# Altium project radFET-calibration_stand.PrjPcb
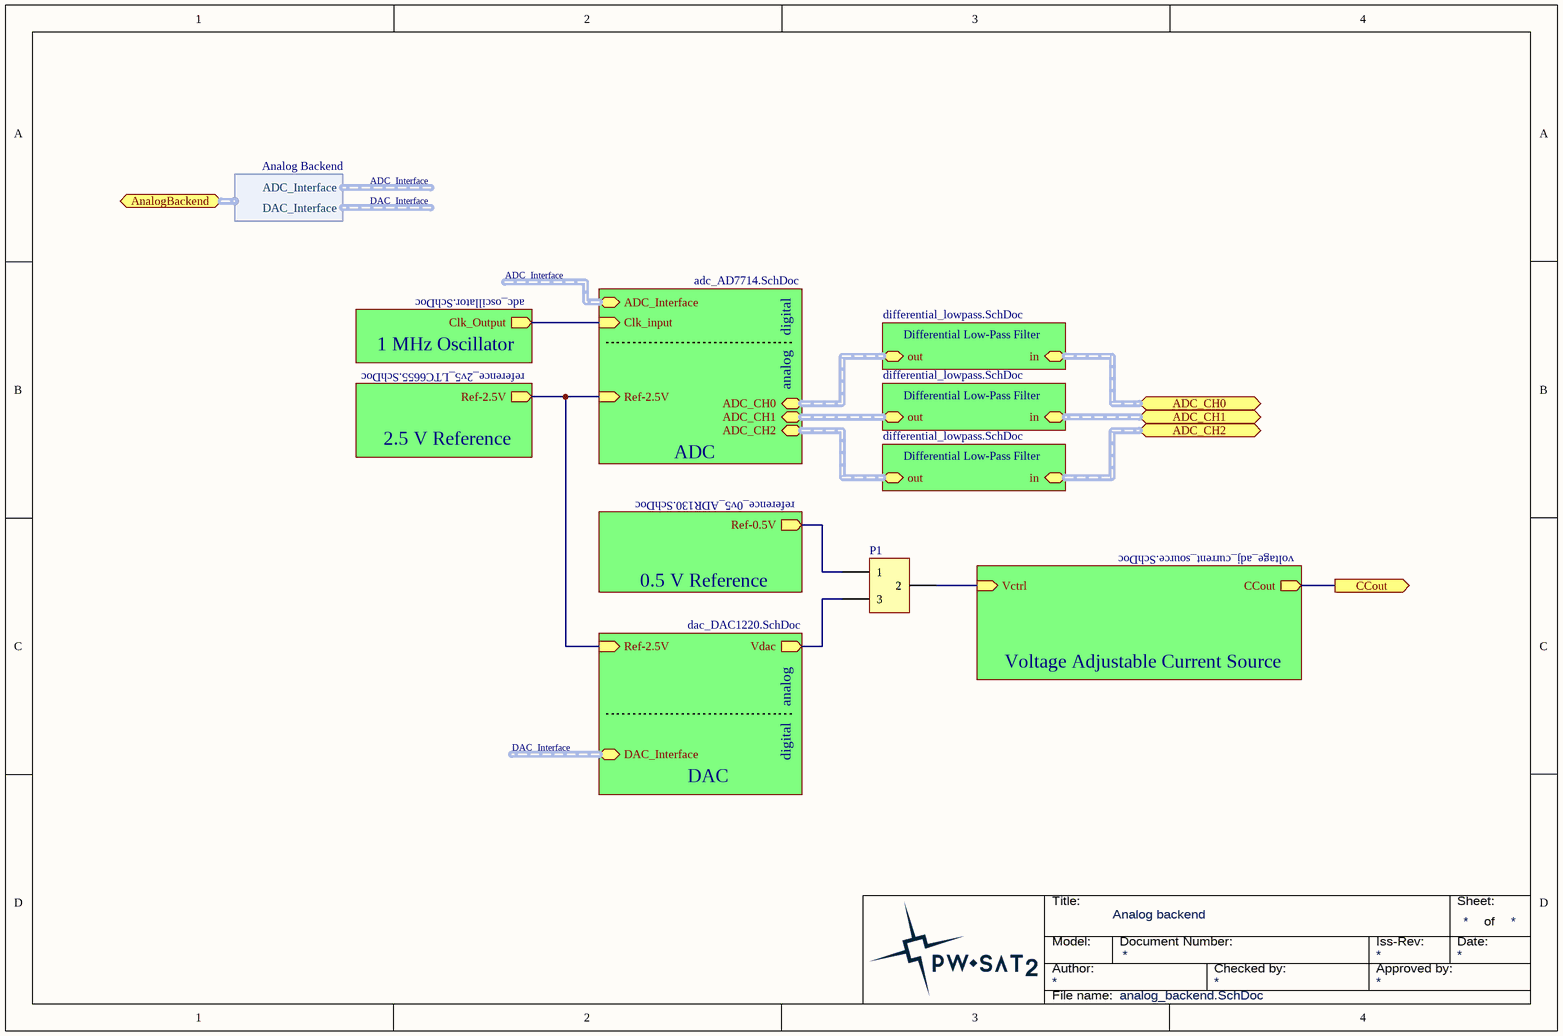
[diagram p0: analog_backend.SchDoc]
11 sheets, 161 parts. Net scope: hierarchical (ports join the sheet entries above them; power ports are global).
Board file: PCB1.PcbDoc
Sheets:
  analog_backend.SchDoc
    ADC = adc_AD7714.SchDoc
    2.5 V Reference = reference_2v5_LTC6655.SchDoc
    Voltage Adjustable Current Source = voltage_adj_current_source.SchDoc
    0.5 V Reference = reference_0v5_ADR130.SchDoc
    Differential Low-Pass Filter = differential_lowpass.SchDoc
    Differential Low-Pass Filter = differential_lowpass.SchDoc
    Differential Low-Pass Filter = differential_lowpass.SchDoc
  mcu_atmega.SchDoc
  rtd_interface_MAX31865.SchDoc
  wifi_ESP8266.SchDoc
  power_unit.SchDoc
  uart_optoizolation.SchDoc

## Sheet analog_backend.SchDoc: Analog backend
size A4

### Parts
P1  Option_Header  [HEADER 1X3 MALE]  (value not drawn)

### Sub-sheets
0.5 V Reference = reference_0v5_ADR130.SchDoc: Ref-0.5V (out)
1 MHz Oscillator = adc_oscillator.SchDoc (file not in this document): Clk_Output (out)
2.5 V Reference = reference_2v5_LTC6655.SchDoc: Ref-2.5V (out)
ADC = adc_AD7714.SchDoc: Ref-2.5V (in), ADC_Interface (harness ADC_DIGITAL), ADC_CH1 (harness ADC Channel), ADC_CH2 (harness ADC Channel), ADC_CH0 (harness ADC Channel), Clk_input (in)
DAC = dac_DAC1220.SchDoc (file not in this document): Ref-2.5V (in), DAC_Interface (harness DAC_DIGITAL), Vdac (out)
Differential Low-Pass Filter = differential_lowpass.SchDoc: out (harness ADC Channel), in (harness ADC Channel)
Differential Low-Pass Filter = differential_lowpass.SchDoc: out (harness ADC Channel), in (harness ADC Channel)
Differential Low-Pass Filter = differential_lowpass.SchDoc: out (harness ADC Channel), in (harness ADC Channel)
Voltage Adjustable Current Source = voltage_adj_current_source.SchDoc: Vctrl (in), CCout (out)

### Ports
ADC_CH0, ADC_CH1, ADC_CH2, AnalogBackend (harness Analog Backend), CCout (out)

### Harnesses
Analog Backend: ADC_Interface, DAC_Interface

### Nets
CCout: port CCout, sheet Voltage Adjustable Current Source/CCout
Clk_input: sheet ADC/Clk_input, sheet 1 MHz Oscillator/Clk_Output
Ref-0.5V: P1.1 ; sheet 0.5 V Reference/Ref-0.5V
Ref-2.5V: sheet ADC/Ref-2.5V, sheet 2.5 V Reference/Ref-2.5V, sheet DAC/Ref-2.5V
Vctrl: P1.2 ; sheet Voltage Adjustable Current Source/Vctrl
NetP1_3: P1.3 ; sheet DAC/Vdac

### Buses and harness runs
harness ADC_Interface = sheet ADC/ADC_Interface
harness DAC_Interface = sheet DAC/DAC_Interface
harness port ADC_CH0 = sheet Differential Low-Pass Filter/in
harness port ADC_CH1 = sheet Differential Low-Pass Filter/in
harness port ADC_CH2 = sheet Differential Low-Pass Filter/in
harness sheet ADC/ADC_CH0 = sheet Differential Low-Pass Filter/out
harness sheet ADC/ADC_CH1 = sheet Differential Low-Pass Filter/out
harness sheet ADC/ADC_CH2 = sheet Differential Low-Pass Filter/out

### Notes on the sheet
- analog
- digital
- Title:
- Sheet:
- of
- Author:
- Model:
- Document Number:
- Checked by:
- Iss-Rev:
- Approved by:
- Date:
- File name:

### Library data of the parts
P1 = Option_Header: Option Header, 3-Pin; LatestRevisionDate: 17-Jul-2002; LatestRevisionNote: Re-released for DXP Platform.; Publisher: Altium Limited

## Sheet adc_AD7714.SchDoc: A 24-bit AD7714YRZ Analog-to-Digital Converter
size A4
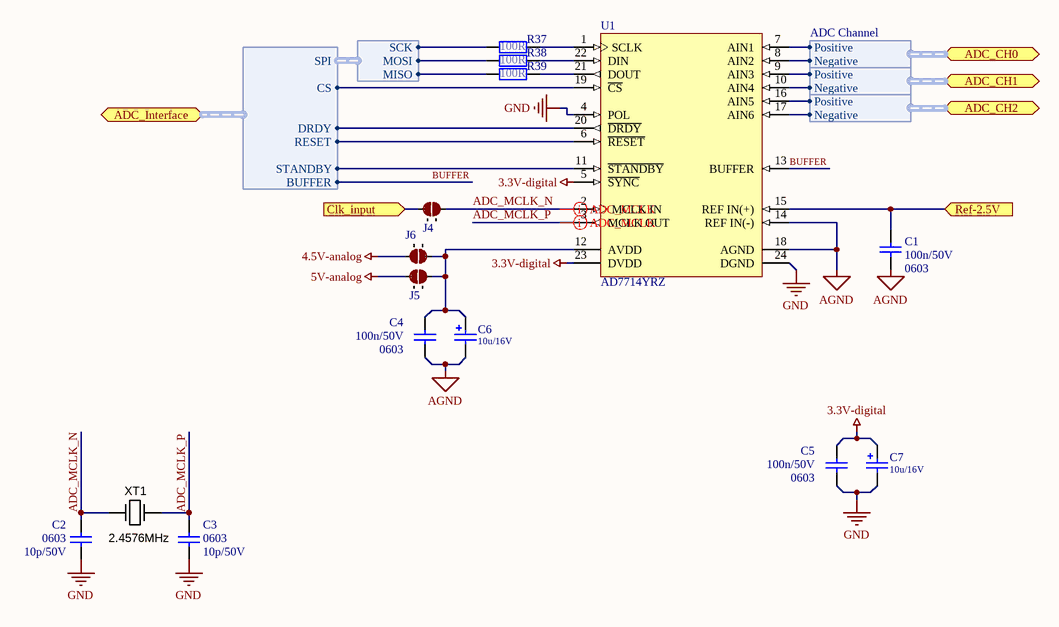
[diagram p1: adc_AD7714.SchDoc]

### Parts
C1  Package: 0603  [SMD_Capacitor_0603]  (hidden comment: 100n/50V)
C2  Package: 0603  [SMD_Capacitor_0603]  (hidden comment: 10p/50V)
C3  Package: 0603  [SMD_Capacitor_0603]  (hidden comment: 10p/50V)
C4  Package: 0603  [SMD_Capacitor_0603]  (hidden comment: 100n/50V)
C5  Package: 0603  [SMD_Capacitor_0603]  (hidden comment: 100n/50V)
C6  10u/16V  [Tantalum_cap_B]
C7  10u/16V  [Tantalum_cap_B]
J4  2 way net solder junction - Normally Open  [2waySolder_NO - 20 mils]  (value not drawn)  (no BOM)
J5  2 way net solder junction - Normally Open  [2waySolder_NO - 20 mils]  (value not drawn)  (no BOM)
J6  2 way net solder junction - Normally Open  [2waySolder_NO - 20 mils]  (value not drawn)  (no BOM)
R37  100R  [0603]
R38  100R  [0603]
R39  100R  [0603]
U1  AD7714YRZ  [RW-24_M]
XT1  2.4576MHz  [HC49U]

### Ports
ADC_CH0 (harness ADC Channel), ADC_CH1 (harness ADC Channel), ADC_CH2 (harness ADC Channel), ADC_Interface (harness ADC_DIGITAL), Clk_input (in), Ref-2.5V (in)

### Harnesses
ADC_DIGITAL: DRDY, RESET, STANDBY, BUFFER, CS, SPI
SPI: SCK, MOSI, MISO
ADC Channel: Positive, Negative

### Nets
3.3V-digital: C5.1 C7.1 U1.5(~{SYNC}) U1.23(DVDD)
4.5V-analog: J6.2
5V-analog: J5.1
AGND: C1.2 C4.2 C6.2 U1.14(REF_IN(-)) U1.18(AGND)
GND: C2.2 C3.2 C5.2 C7.2 U1.4(POL) U1.24(DGND)
ADC_Interface.CS: U1.19(~{CS}) ; port ADC_Interface.CS
ADC_Interface.DRDY: U1.20(~{DRDY}) ; port ADC_Interface.DRDY
ADC_Interface.RESET: U1.6(~{RESET}) ; port ADC_Interface.RESET
ADC_Interface.STANDBY: U1.11(~{STANDBY}) ; port ADC_Interface.STANDBY
ADC_MCLK_N: C2.1 J4.2 U1.2(MCLK_IN) XT1.1(IN)
ADC_MCLK_P: C3.1 U1.3(MCLK_OUT) XT1.2(OUT)
BUFFER: U1.13(BUFFER) ; port ADC_Interface.BUFFER  [project net ADC_Interface.BUFFER]
Clk_input: J4.1 ; port Clk_input
Ref-2.5V: C1.1 U1.15(REF_IN(+)) ; port Ref-2.5V
NetC4_1: C4.1 C6.1 J5.2 J6.1 U1.12(AVDD)
NetC89_Differential_Low-Pass_Filter#1_1: U1.7(AIN1) ; port ADC_CH0.Positive
NetC89_Differential_Low-Pass_Filter#2_1: U1.9(AIN3) ; port ADC_CH1.Positive
NetC89_Differential_Low-Pass_Filter#3_1: U1.16(AIN5) ; port ADC_CH2.Positive
NetC90_Differential_Low-Pass_Filter#1_2: U1.8(AIN2) ; port ADC_CH0.Negative
NetC90_Differential_Low-Pass_Filter#2_2: U1.10(AIN4) ; port ADC_CH1.Negative
NetC90_Differential_Low-Pass_Filter#3_2: U1.17(AIN6) ; port ADC_CH2.Negative
NetR37_1: R37.1 ; harness SPI.SCK
NetR37_2: R37.2 U1.1(SCLK)
NetR38_1: R38.1 ; harness SPI.MOSI
NetR38_2: R38.2 U1.22(DIN)
NetR39_1: R39.1 ; harness SPI.MISO
NetR39_2: R39.2 U1.21(DOUT)

### Layout directives
differential pair: ADC_MCLK_N, ADC_MCLK_P

### Notes on the sheet
- Title:
- Sheet:
- of
- Author:
- Model:
- Document Number:
- Checked by:
- Iss-Rev:
- Approved by:
- Date:
- File name:

### Library data of the parts
C1 C4 C5 = Cer_C0603T104K5RALTU: Ceramic Cap Kemet COTS 100n/50V X7R 0603; Manufacturer: Kemet; ManufacturerPartNumber: C0603T104K5RALTU; Value: 100n/50V
C2 C3 = Cer_GCM1885C1H100JA16D: Ceramic Cap Murata Automotive 10p/50V C0G 0603; Manufacturer: Murata; ManufacturerPartNumber: GCM1885C1H100JA16D; Value: 10p/50V
C6 C7 = Cap Tantalum: Tantalum Capacitor; Value: 10u/16V
J4-J6 = 2waySolderNO: ComponentLink1URL: http://www.edatools.cz/addons; ComponentLink1Description: Source
R37-R39 = Res: Generic resistor; value: 100R
U1 = AD7714YRZ: 5 Channel 24-Bit Signal Conditioning Analog-to-Digital Converter with Serial, SPI Interface, 500 uA, CMOS, 3 V / 5 V, 1KSPS, -40 to +105 degC, RW-24, Pb-Free, Tube; Generic Part Number: AD7714; Manufacturer: Analog Devices; Resolution (Bits): 24; Channels: 5; Throughput Rate (SPS): 1K; Interface: Ser, SPI; DatasheetVersion: Rev.C; PackageVersion: 060706-A; PackageReference: RW-24; PackageDescription: 24-Lead Standard Small Outline Package [SOIC_W]; Supplier 1: Digi-Key; Supplier Part Number 1: AD7714YRZ-ND; Supplier 2: Farnell; Supplier Part Number 2: 1438858; Supplier 3: Newark; Supplier Part Number 3: 15P0854; Supplier 4: Newark; Supplier Part Number 4: 59K5335; Supplier 5: Mouser; Supplier Part Number 5: 584-AD7714YRZ; RoHS: Y; Packing: Tube; Mounting Technology: Surface Mount; Code_JEDEC: MS-013-AD; PartNumber: AD7714YRZ; ComponentLink1Description: Manufacturer URL; ComponentLink1URL: http://www.analog.com/en/index.html; ComponentLink2Description: Datasheet; ComponentLink2URL: http://www.analog.com/static/imported-files/data_sheets/AD7714.pdf; ComponentLink3Description: Package Specification; ComponentLink3URL: http://www.analog.com/static/imported-files/packages/33665150946139RW_24.pdf; ComponentLink4Description: Product URL; ComponentLink4URL: http://www.analog.com/en/analog-to-digital-converters/ad-converters/ad7714/products/product.html
XT1 = Crystal: AKER  C-2.4576-18-3050-X; Manufacturer 1: Citizen Finetech Miyota; Manufacturer Part Number 1: CMR309T-6.000MABJ-UT; Ratings: 6.00 MHz; Frequency: 6MHz; Frequency Stability: ±50ppm; Frequency Tolerance: ±30ppm; Load Capacitance: 18pF; Operating Mode: Fundamental; SCDType: spec; Package / Case: Cylindrical Can, Radial; Type: MHz Crystal; Operating Temperature: -10°C ~ 60°C; Mounting Type: Surface Mount; Size / Dimension: 0.118" Dia x 0.346" L (3.00mm x 8.80mm); Height: 0.122" (3.10mm); Supplier 1: Digi-Key; Supplier Part Number 1: 300-8348-1-ND; Tolerance: ±50ppm; ComponentLink1URL: http://media.digikey.com/pdf/Data%20Sheets/Citizen%20PDFs/CMR310T%20CMR309T.pdf; ComponentLink1Description: http://media.digikey.com/pdf/Data%20Sheets/Citizen%20PDFs/CMR310T%20CMR309T.pdf; Value: 2.4576MHz

## Sheet reference_2v5_LTC6655.SchDoc
size A4
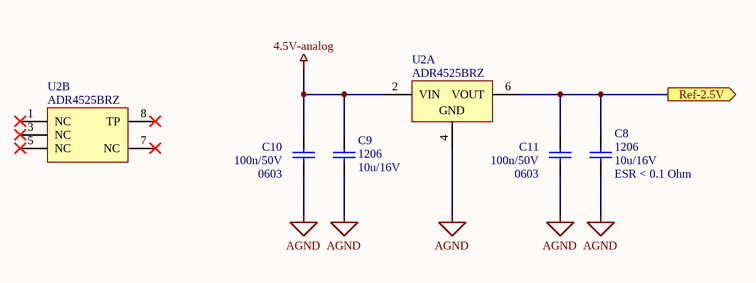
[diagram p2: reference_2v5_LTC6655.SchDoc]

### Parts
C8  Packge: 1206  [SMD_Capacitor_1206]  (hidden comment: 10u/16V)
C9  Packge: 1206  [SMD_Capacitor_1206]  (hidden comment: 10u/16V)
C10  Package: 0603  [SMD_Capacitor_0603]  (hidden comment: 100n/50V)
C11  Package: 0603  [SMD_Capacitor_0603]  (hidden comment: 100n/50V)
U2  ADR4525BRZ  [ADI-R-8_N]  (parts A,B of 2)

### Ports
Ref-2.5V (out)

### Nets
4.5V-analog: C9.1 C10.1 U2.2(VIN)
AGND: C8.2 C9.2 C10.2 C11.2 U2.4(GND)
Ref-2.5V: C8.1 C11.1 U2.6(VOUT) ; port Ref-2.5V

Not connected (* = marked no-connect by the designer): U2 1(NC)* 3(NC)* 5(NC)* 7(NC)* 8(TP)*

### Notes on the sheet
- (near C8) ESR < 0.1 Ohm
- Title:
- Sheet:
- of
- Author:
- Model:
- Document Number:
- Checked by:
- Iss-Rev:
- Approved by:
- Date:
- File name:

### Library data of the parts
C8 C9 = Cer_C1206T106K4RACTU: Ceramic Cap Kemet COTS 10u/16V X7R 1206; ManufacturerPartNumber: C1206T106K4RACTU; Manufacturer: Kemet; Value: 10u/16V
C10 C11 = Cer_C0603T104K5RALTU: Ceramic Cap Kemet COTS 100n/50V X7R 0603; Manufacturer: Kemet; ManufacturerPartNumber: C0603T104K5RALTU; Value: 100n/50V
U2 = ADR4525BRZ: Ultralow Noise, High Accuracy Voltage Reference, 2.5 V Output, 3 to 15 V Supply, Industrial, 8-pin SOIC (R-8), Tube; Manufacturer: Analog Devices; Max V Supply (V): 15; Min V Supply (V): 3; Ref Out TC (ppm/C): 2; Vout: 2.5V; DatasheetVersion: Rev. 0; PackageVersion: 060506-A, 06/2006; PackageReference: R-8; PackageDescription: 8-Pin Standard Small Outline Package, Body 4.9 x 3.9 mm, Pitch 1.27 mm; Supplier 1: Digi-Key; Supplier Part Number 1: ADR4525BRZ-ND; Supplier 2: Farnell; Supplier Part Number 2: 2112686; Supplier 3: Farnell; Supplier Part Number 3: 2148887; Supplier 4: Mouser; Supplier Part Number 4: 584-ADR4525BRZ; Packing: Tube; Operating Temp Range: -40 to 125 degC; Mounting Technology: Surface Mount; Code_JEDEC: MS-012-AA; PartNumber: ADR4525BRZ; ComponentLink1Description: Manufacturer URL; ComponentLink1URL: http://www.analog.com/en/index.html; ComponentLink2Description: Datasheet; ComponentLink2URL: http://www.analog.com/static/imported-files/data_sheets/ADR4520_4525_4530_4533_4540_4550.pdf; ComponentLink3Description: Package Specification; ComponentLink3URL: http://www.analog.com/static/imported-files/packages/PKG_PDF/SOIC_Narrow%20(R)/R_8.pdf; ComponentLink4Description: URL Link1; ComponentLink4URL: Product URL:http://www.analog.com/en/special-linear-functions/voltage-references/adr4525/products/product.html

## Sheet voltage_adj_current_source.SchDoc: Voltage adjustable current source
size A4
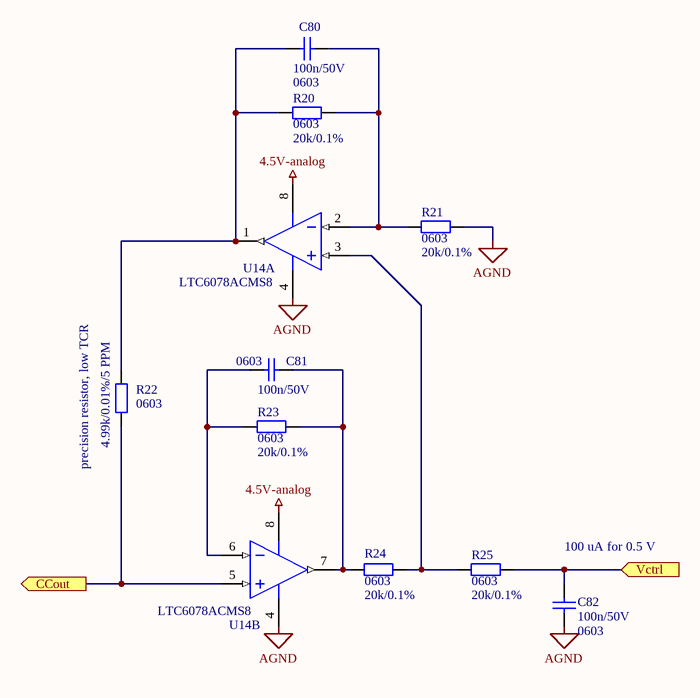
[diagram p3: voltage_adj_current_source.SchDoc]

### Parts
C80  Package: 0603  [SMD_Capacitor_0603]  (hidden comment: 100n/50V)
C81  Package: 0603  [SMD_Capacitor_0603]  (hidden comment: 100n/50V)
C82  Package: 0603  [SMD_Capacitor_0603]  (hidden comment: 100n/50V)
R20  0603  value 20k/0.1%  [SMD_Resistor_0603]
R21  0603  value 20k/0.1%  [SMD_Resistor_0603]
R22  0603  value 4.99k/0.01%/5 PPM  [SMD_Resistor_0603]
R23  0603  value 20k/0.1%  [SMD_Resistor_0603]
R24  0603  value 20k/0.1%  [SMD_Resistor_0603]
R25  0603  value 20k/0.1%  [SMD_Resistor_0603]
U14  LTC6078ACMS8  [LT-MS8-8_N]  (parts A,B of 2)

### Ports
CCout (out), Vctrl (in)

### Nets
4.5V-analog: U14.8(V+)
AGND: C82.1 R21.1 U14.4(V-)
CCout: R22.1 U14.5(+INB) ; port CCout
Vctrl: C82.2 R25.1 ; port Vctrl
NetC80_1: C80.1 R20.2 R22.2 U14.1(OUTA)
NetC80_2: C80.2 R20.1 R21.2 U14.2(-INA)
NetC81_1: C81.1 R23.2 U14.6(-INB)
NetC81_2: C81.2 R23.1 R24.2 U14.7(OUTB)
NetR24_1: R24.1 R25.2 U14.3(+INA)

### Notes on the sheet
- (near R22) precision resistor, low TCR
- 100 uA for 0.5 V
- Title:
- Sheet:
- of
- Author:
- Model:
- Document Number:
- Checked by:
- Iss-Rev:
- Approved by:
- Date:
- File name:

### Library data of the parts
C80-C82 = Cer_C0603T104K5RALTU: Ceramic Cap Kemet COTS 100n/50V X7R 0603; Manufacturer: Kemet; ManufacturerPartNumber: C0603T104K5RALTU; Value: 100n/50V
R20-R25 = Res2: Resistor; Published: 8-Jun-2000; LatestRevisionDate: 17-Jul-2002; LatestRevisionNote: Re-released for DXP Platform.; PackageReference: AXIAL-0.4; Publisher: Altium Limited; PackageDescription: Axial Device, Thru-Hole; 2 Leads; 0.4 in Pin Spacing
U14 = LTC6078ACMS8: Dual Channel, Micropower, Precision Operational Amplifier, RRIO, 0.75 MHz Typical GBW, 0.05 V/us Typical SR, 2.7 to 5.5 V, 8-Pin SOP (MS8-8), Commercial; Manufacturer: Linear Technology; Channels (#): 2; GBW (MHz) Typical: 0.75; Is (mA) Typical: 0.054; SR (V/us) Typical: 0.05; Vos (mV) Typical: 0.007; Vs Max (V): 5.5; Vs Min (V): 2.7; DatasheetVersion: Rev. A; PackageVersion: Rev G; PackageReference: LT-MS8-8; PackageDescription: 8-Lead Plastic Small Outline, Body 3.9 x 4.9 mm, Pitch 1.27 mm; Supplier 1: Digi-Key; Supplier Part Number 1: LTC6078ACMS8-ND; Supplier 2: Newark; Supplier Part Number 2: 56M9730; Linear Technology Part Number: LTC6078; Type: VFB; Mounting Technology: Surface Mount; PartNumber: LTC6078ACMS8; ComponentLink1Description: Manufacturer URL; ComponentLink1URL: http://www.linear.com/; ComponentLink2Description: Datasheet; ComponentLink2URL: http://cds.linear.com/docs/en/datasheet/60789fa.pdf; ComponentLink3Description: Package Specification; ComponentLink3URL: http://cds.linear.com/docs/en/packaging/05081610_G_SO8.pdf

## Sheet reference_0v5_ADR130.SchDoc: 0.5 V Fixed reference voltage
size A4
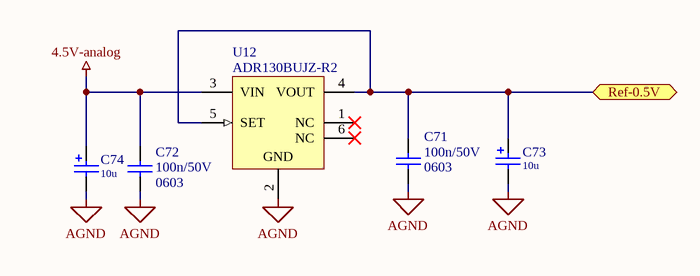
[diagram p4: reference_0v5_ADR130.SchDoc]

### Parts
C71  Package: 0603  [SMD_Capacitor_0603]  (hidden comment: 100n/50V)
C72  Package: 0603  [SMD_Capacitor_0603]  (hidden comment: 100n/50V)
C73  10u  [Tantalum_cap_B]
C74  10u  [Tantalum_cap_B]
U12  ADR130BUJZ-R2  [ADI-UJ-6_M]

### Ports
Ref-0.5V

### Nets
4.5V-analog: C72.1 C74.1 U12.3(VIN)
AGND: C71.2 C72.2 C73.2 C74.2 U12.2(GND)
Ref-0.5V: C71.1 C73.1 U12.4(VOUT) U12.5(SET) ; port Ref-0.5V

Not connected (* = marked no-connect by the designer): U12 1(NC)* 6(NC)*

### Notes on the sheet
- Title:
- Sheet:
- of
- Author:
- Model:
- Document Number:
- Checked by:
- Iss-Rev:
- Approved by:
- Date:
- File name:

### Library data of the parts
C71 C72 = Cer_C0603T104K5RALTU: Ceramic Cap Kemet COTS 100n/50V X7R 0603; Manufacturer: Kemet; ManufacturerPartNumber: C0603T104K5RALTU; Value: 100n/50V
C73 C74 = Cap Tantalum: Tantalum Capacitor; Value: 10u
U12 = ADR130BUJZ-R2: Precision Series Sub-Band Gap Voltage Reference, 1 V Output, 2 to 18 V Supply, Industrial, 6-pin SOT23 (UJ-6), Reel; Manufacturer: Analog Devices; Max V Supply (V): 18; Min V Supply (V): 2; Ref Out TC (ppm/C): 5; Vout: 0.5V, 1V; DatasheetVersion: Rev. B; PackageVersion: Dec-04; PackageReference: UJ-6; PackageDescription: 6-Pin Thin Small Outline Transistor Package, Body 2.9 x 1.6 mm, Pitch 0.95 mm; Supplier 1: Digi-Key; Supplier Part Number 1: ADR130BUJZ-R2TR-ND; Supplier 2: Digi-Key; Supplier Part Number 2: ADR130BUJZ-R2CT-ND; Supplier 3: Digi-Key; Supplier Part Number 3: ADR130BUJZ-R2DKR-ND; Supplier 4: Farnell; Supplier Part Number 4: 1699555; Supplier 5: Mouser; Supplier Part Number 5: 584-ADR130BUJZ-R2; Packing: Reel; Operating Temp Range: -40 to 125 degC; Mounting Technology: Surface Mount; Code_JEDEC: MO-193-AA; PartNumber: ADR130BUJZ-R2; ComponentLink1Description: Manufacturer URL; ComponentLink1URL: http://www.analog.com/en/index.html; ComponentLink2Description: Datasheet; ComponentLink2URL: http://www.analog.com/static/imported-files/data_sheets/ADR130.pdf; ComponentLink3Description: Package Specification; ComponentLink3URL: http://www.analog.com/static/imported-files/packages/PKG_PDF/TSOT(UJ)/UJ_6.pdf; ComponentLink4Description: URL Link1; ComponentLink4URL: Product URL:http://www.analog.com/en/special-linear-functions/voltage-references/adr130/products/product.html

## Sheet differential_lowpass.SchDoc: Differential low-pass filter
size A4
Used 3 times, as channels Differential Low-Pass Filter, Differential Low-Pass Filter, Differential Low-Pass Filter. Parts and nets are listed once, with the designators drawn on the sheet.
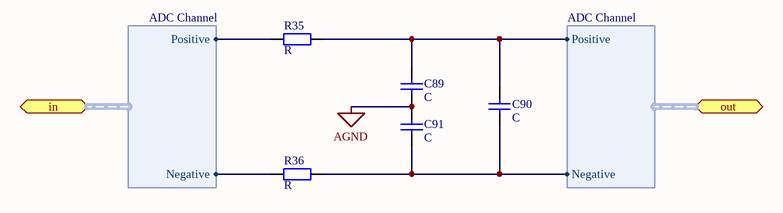
[diagram p5: differential_lowpass.SchDoc]

### Parts
C89  C  [C0603]
C90  C  [C0603]
C91  C  [C0603]
R35  R  [0603]
R36  R  [0603]

### Ports
in (harness ADC Channel), out (harness ADC Channel)

### Harnesses
ADC Channel: Positive, Negative

### Nets
AGND: C89.2 C91.1
NetC89_1: C89.1 C90.1 R35.2 ; port out.Positive
NetC90_2: C90.2 C91.2 R36.2 ; port out.Negative
NetR35_1: R35.1 ; port in.Positive
NetR36_1: R36.1 ; port in.Negative

### Channels
Differential Low-Pass Filter: designators end in _Differential_Low-Pass_Filter#1
Differential Low-Pass Filter: designators end in _Differential_Low-Pass_Filter#2
Differential Low-Pass Filter: designators end in _Differential_Low-Pass_Filter#3

### Notes on the sheet
- Title:
- Sheet:
- of
- Author:
- Model:
- Document Number:
- Checked by:
- Iss-Rev:
- Approved by:
- Date:
- File name:

### Library data of the parts
C89-C91 = Cap: Generic capacitor; value: C
R35 R36 = Res: Generic resistor; value: R

## Sheet mcu_atmega.SchDoc: Microcontroller unit
size A3
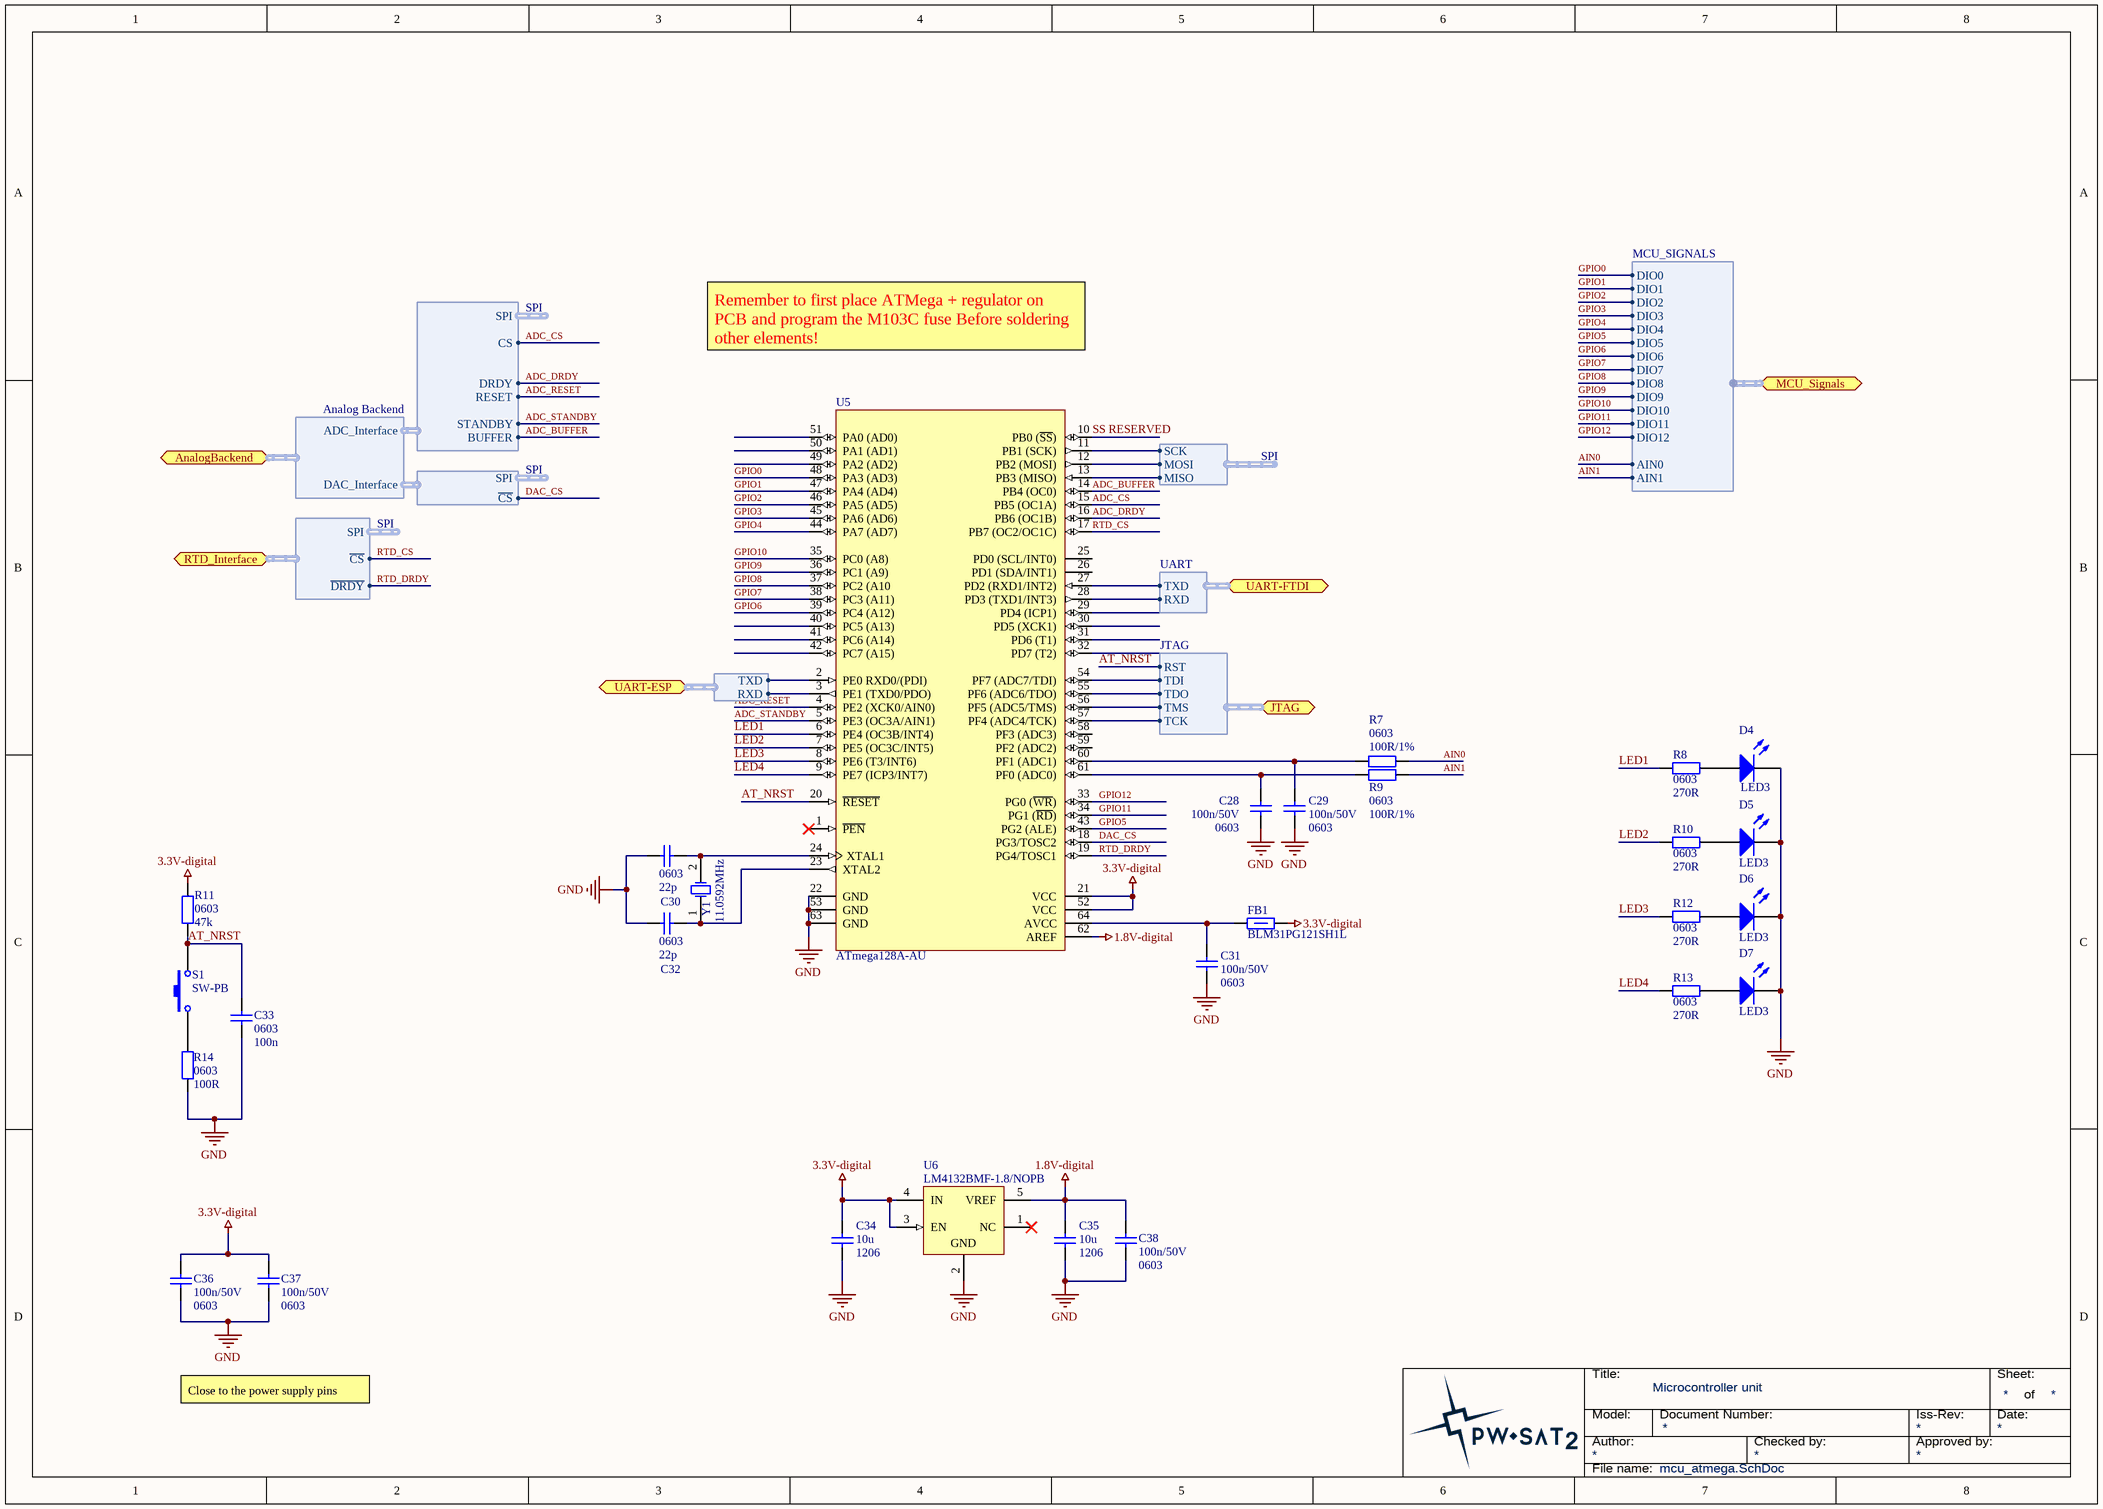
[diagram p6: mcu_atmega.SchDoc]

### Parts
C28  Package: 0603  [SMD_Capacitor_0603]  (hidden comment: 100n/50V)
C29  Package: 0603  [SMD_Capacitor_0603]  (hidden comment: 100n/50V)
C30  0603  value 22p  [SMD_Capacitor_0603]
C31  Package: 0603  [SMD_Capacitor_0603]  (hidden comment: 100n/50V)
C32  0603  value 22p  [SMD_Capacitor_0603]
C33  0603  value 100n  [SMD_Capacitor_0603]
C34  value 10u  Package: 1206  [SMD_Capacitor_1206]  (hidden comment: Cap)
C35  value 10u  Package: 1206  [SMD_Capacitor_1206]  (hidden comment: Cap)
C36  Package: 0603  [SMD_Capacitor_0603]  (hidden comment: 100n/50V)
C37  Package: 0603  [SMD_Capacitor_0603]  (hidden comment: 100n/50V)
C38  Package: 0603  [SMD_Capacitor_0603]  (hidden comment: 100n/50V)
D4  LED3  [LED 0805 Blue]
D5  LED3  [LED 0805 Yellow]
D6  LED3  [LED 0805 GREEN]
D7  LED3  [LED 0805 RED]
FB1  120R/100MHz  [SMD_FerriteBead_1206]  (value not drawn)
R7  Package: 0603  [SMD_Resistor_0603]  (hidden comment: 100R/1%)
R8  0603  value 270R  [SMD_Resistor_0603]
R9  Package: 0603  [SMD_Resistor_0603]  (hidden comment: 100R/1%)
R10  0603  value 270R  [SMD_Resistor_0603]
R11  0603  value 47k  [SMD_Resistor_0603]
R12  0603  value 270R  [SMD_Resistor_0603]
R13  0603  value 270R  [SMD_Resistor_0603]
R14  0603  value 100R  [SMD_Resistor_0603]
S1  SW-PB  [Tact Switch 3x6]
U5  ATmega128A-AU  [64A_M]
U6  LM4132BMF-1.8/NOPB  [MF05A_N]
Y1  11.0592MHz  [CRYSTAL_HC49-US-SM]

### Ports
AnalogBackend (harness Analog Backend), JTAG (harness JTAG), MCU_Signals (harness MCU_SIGNALS), RTD_Interface (harness RTD_DIGITAL), UART-ESP (harness UART), UART-FTDI (harness UART)

### Harnesses
JTAG: TCK, TMS, TDO, TDI, RST
SPI: SCK, MOSI, MISO
UART: RXD, TXD
UART: TXD, RXD
Analog Backend: ADC_Interface, DAC_Interface
ADC_DIGITAL: DRDY, RESET, STANDBY, BUFFER, CS, SPI
DAC_DIGITAL: SPI, ~{CS}
RTD_DIGITAL: SPI, ~{CS}, ~{DRDY}
MCU_SIGNALS: DIO0, AIN0, AIN1, DIO1, DIO2, DIO3, DIO4, DIO5, DIO6, DIO7, DIO8, DIO9, DIO10, DIO11, DIO12

### Nets
1.8V-digital: C35.1 C38.1 U5.62(AREF) U6.5(VREF)
3.3V-digital: C34.1 C36.1 C37.1 FB1.1 R11.2 U5.21(VCC) U5.52(VCC) U6.3(EN) U6.4(IN)
GND: C28.2 C29.2 C30.1 C31.2 C32.1 C33.1 C34.2 C35.2 C36.2 C37.2 C38.2 D4.2(K) D5.2(K) D6.2(K) D7.2(K) R14.2 U5.22(GND) U5.53(GND) U5.63(GND) U6.2(GND)
ADC_BUFFER: U5.14(PB4_(OC0)) ; harness ADC_DIGITAL.BUFFER
ADC_CS: U5.15(PB5_(OC1A)) ; harness ADC_DIGITAL.CS
ADC_DRDY: U5.16(PB6_(OC1B)) ; harness ADC_DIGITAL.DRDY
ADC_RESET: U5.4(PE2_(XCK0/AIN0)) ; harness ADC_DIGITAL.RESET
ADC_STANDBY: U5.5(PE3_(OC3A/AIN1)) ; harness ADC_DIGITAL.STANDBY
AIN0: R7.1 ; port MCU_Signals.AIN0
AIN1: R9.2 ; port MCU_Signals.AIN1
AT_NRST: C33.2 R11.1 S1.2 U5.20(~{RESET}) ; port JTAG.RST
DAC_CS: U5.18(PG3/TOSC2) ; harness DAC_DIGITAL.~{CS}
GPIO0: U5.48(PA3_(AD3)) ; port MCU_Signals.DIO0
GPIO1: U5.47(PA4_(AD4)) ; port MCU_Signals.DIO1
GPIO2: U5.46(PA5_(AD5)) ; port MCU_Signals.DIO2
GPIO3: U5.45(PA6_(AD6)) ; port MCU_Signals.DIO3
GPIO4: U5.44(PA7_(AD7)) ; port MCU_Signals.DIO4
GPIO5: U5.43(PG2_(ALE)) ; port MCU_Signals.DIO5
GPIO6: U5.39(PC4_(A12)) ; port MCU_Signals.DIO6
GPIO7: U5.38(PC3_(A11)) ; port MCU_Signals.DIO7
GPIO8: U5.37(PC2_(A10) ; port MCU_Signals.DIO8
GPIO9: U5.36(PC1_(A9)) ; port MCU_Signals.DIO9
GPIO10: U5.35(PC0_(A8)) ; port MCU_Signals.DIO10
GPIO11: U5.34(PG1_(~{RD})) ; port MCU_Signals.DIO11
GPIO12: U5.33(PG0_(~{WR})) ; port MCU_Signals.DIO12
LED1: R8.2 U5.6(PE4_(OC3B/INT4))
LED2: R10.2 U5.7(PE5_(OC3C/INT5))
LED3: R12.2 U5.8(PE6_(T3/INT6))
LED4: R13.2 U5.9(PE7_(ICP3/INT7))
RTD_CS: U5.17(PB7_(OC2/OC1C)) ; port RTD_Interface.~{CS}
RTD_DRDY: U5.19(PG4/TOSC1) ; port RTD_Interface.~{DRDY}
SPI.MISO: U5.13(PB3_(MISO)) ; harness SPI.MISO
SPI.MOSI: U5.12(PB2_(MOSI)) ; harness SPI.MOSI
SPI.SCK: U5.11(PB1_(SCK)) ; harness SPI.SCK
SS RESERVED: U5.10(PB0_(~{SS}))
NetC28_1: C28.1 R9.1 U5.61(PF0_(ADC0))
NetC29_1: C29.1 R7.2 U5.60(PF1_(ADC1))
NetC30_2: C30.2 U5.24(XTAL1) Y1.2(OSC2)
NetC31_1: C31.1 FB1.2 U5.64(AVCC)
NetC32_2: C32.2 U5.23(XTAL2) Y1.1(OSC1)
NetD4_1: D4.1(A) R8.1
NetD5_1: D5.1(A) R10.1
NetD6_1: D6.1(A) R12.1
NetD7_1: D7.1(A) R13.1
NetR14_1: R14.1 S1.1
NetU5_2: U5.2(PE0_RXD0/(PDI)) ; port UART-ESP.TXD
NetU5_3: U5.3(PE1_(TXD0/PDO)) ; port UART-ESP.RXD
NetU5_27: U5.27(PD2_(RXD1/INT2)) ; port UART-FTDI.TXD
NetU5_28: U5.28(PD3_(TXD1/INT3)) ; port UART-FTDI.RXD
NetU5_54: U5.54(PF7_(ADC7/TDI)) ; port JTAG.TDI
NetU5_55: U5.55(PF6_(ADC6/TDO)) ; port JTAG.TDO
NetU5_56: U5.56(PF5_(ADC5/TMS)) ; port JTAG.TMS
NetU5_57: U5.57(PF4_(ADC4/TCK)) ; port JTAG.TCK

Not connected (* = marked no-connect by the designer): U5 1(~{PEN})* 25(PD0_(SCL/INT0)) 26(PD1_(SDA/INT1)) 29(PD4_(ICP1)) 30(PD5_(XCK1)) 31(PD6_(T1)) 32(PD7_(T2)) 40(PC5_(A13)) 41(PC6_(A14)) 42(PC7_(A15)) 49(PA2_(AD2)) 50(PA1_(AD1)) 51(PA0_(AD0)) 58(PF3_(ADC3)) 59(PF2_(ADC2)); U6 1(NC)*

### Notes on the sheet
- Remember to first place ATMega + regulator on PCB and program the M103C fuse Before soldering other elements!
- Close to the power supply pins
- Title:
- Sheet:
- of
- Author:
- Model:
- Document Number:
- Checked by:
- Iss-Rev:
- Approved by:
- Date:
- File name:

### Library data of the parts
C28 C29 C31 C36-C38 = Cer_C0603T104K5RALTU: Ceramic Cap Kemet COTS 100n/50V X7R 0603; Manufacturer: Kemet; ManufacturerPartNumber: C0603T104K5RALTU; Value: 100n/50V
C30 C32 = Cap1: Capacitor; Published: 8-Jun-2000; LatestRevisionDate: 17-Jul-2002; LatestRevisionNote: Re-released for DXP Platform.; PackageReference: RAD-0.3; Publisher: Altium Limited; PackageDescription: Radial Cap, Thru-Hole; 2 Leads; 0.3 in Pin Spacing
C33 = Cap: Capacitor; Published: 8-Jun-2000; LatestRevisionDate: 17-Jul-2002; LatestRevisionNote: Re-released for DXP Platform.; PackageReference: RAD-0.3; Publisher: Altium Limited; PackageDescription: Radial Cap, Thru-Hole; 2 Leads; 0.3 in Pin Spacing
D4-D7 = LED3: Typical BLUE SiC LED; Published: 8-Jun-2000; LatestRevisionDate: 17-Dec-2003; LatestRevisionNote: PCB Footprint replaced.; DatasheetVersion: 16-Apr-2002; PackageVersion: 16-Apr-2002; PackageReference: 3.5X2.8X1.9; Publisher: Altium Limited; PackageDescription: SM LED; 2 C-Bend Leads; Body 3.5 x 2.8 x 1.9 mm, inc leads (LxWxH typ)
FB1 = BLM31PG121SH1L: Ferrite bead, 1206, 0.02HM, 3.5A.; Manufacturer: Murata; Current Rating: 3.5A; Series Resistance DC: 0.02R; Package: 1206; Value: 120R/100MHz; ManufacturerPartNumber: BLM31PG121SH1L
R7 R9 = CRCW0603100RFKxxxx: 100R/1% Vishay CRCW 0603 Resistor. 100mW, 100ppm, 75V.; Manufacturer: Vishay; ManufacturerPartNumber: CRCW0603100RFKxxxx; Value: 100R/1%
R8 R10-R14 = Res2: Resistor; Published: 8-Jun-2000; LatestRevisionDate: 17-Jul-2002; LatestRevisionNote: Re-released for DXP Platform.; PackageReference: AXIAL-0.4; Publisher: Altium Limited; PackageDescription: Axial Device, Thru-Hole; 2 Leads; 0.4 in Pin Spacing
S1 = SW-PB: Switch; Published: 24-Mar-1999; LatestRevisionDate: 17-Jul-2002; LatestRevisionNote: Re-released for DXP Platform.; PackageReference: SPST-2; Publisher: Altium Limited; PackageDescription: Switch; 2 Leads
U5 = ATmega128A-AU: 8-bit AVR Microcontroller, 2.7-5.5V, 16MHz, 128KB Flash, 4KB EEPROM, 4KB SRAM, 64-pin TQFP, Industrial Grade (-40°C to 85°C); DatasheetVersion: revH, Feb-2011; PackageVersion: revC, Oct-2010; PackageReference: 64A; PackageDescription: 64-Pin Plastic Thin Profile Quad Flat Pack, 14 x 14 x 1.0 mm Body, 0.8 mm Pitch (TQFP); Code_JEDEC: MS-026-AEB; ComponentLink1Description: Manufacturer URL; ComponentLink1URL: http://www.atmel.com/; ComponentLink2Description: ATmega128A Datasheet; ComponentLink2URL: http://www.atmel.com/dyn/resources/prod_documents/doc8151.pdf; ComponentLink3Description: ATmega128A Summary; ComponentLink3URL: http://www.atmel.com/dyn/resources/prod_documents/8151S.pdf
U6 = LM4132BMF-1.8/NOPB: Precision Low Dropout Voltage Reference, 5-pin SOT-23, Pb-Free; Manufacturer: National Semiconductor; PackageTopMarking: R4AB*XTT; PowerWise: Y; CompType: Voltage Reference IC; DatasheetVersion: Aug-2006; PackageVersion: revD, Aug-2008; PackageReference: MF05A; PackageDescription: Molded SOT-23, .115 x .063 x .040 in Body, 5 Lead, .0375 in Pitch; PartNumber: LM4132BMF-1.8/NOPB; RoHS: Y; PinCount: 5; High-Reliability: Y; ComponentLink1Description: Manufacturer URL; ComponentLink1URL: http://www.national.com/; ComponentLink2Description: LM4132 Datasheet; ComponentLink2URL: http://www.national.com/ds/LM/LM4132.pdf; ComponentLink3Description: LM4132 Web Page; ComponentLink3URL: http://www.national.com/pf/LM/LM4132.html; ComponentLink4Description: MF05A Package Page; ComponentLink4URL: http://www.national.com/packaging/folders/mf05a.html
Y1 = XTAL: LF XTAL003519; Published: 8-Jun-2000; LatestRevisionDate: 17-Jul-2002; LatestRevisionNote: Re-released for DXP Platform.; PackageReference: R38; Publisher: Altium Limited; PackageDescription: Crystal, Thru-Hole; 2 Leads; Body 3.1 x 8.2 mm (Dia.xH)

## Sheet rtd_interface_MAX31865.SchDoc: RTD interface
size A4
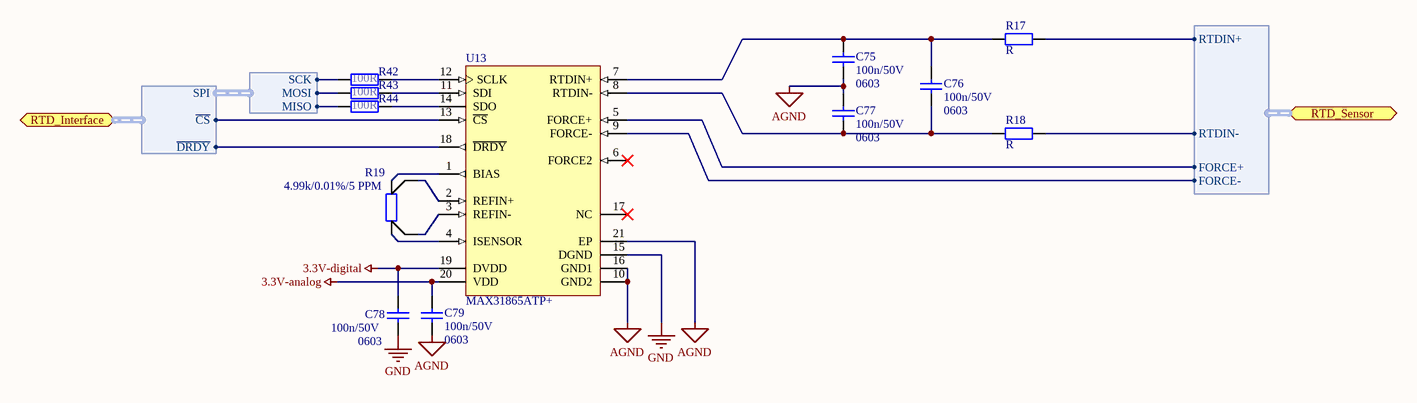
[diagram p7: rtd_interface_MAX31865.SchDoc]

### Parts
C75  Package: 0603  [SMD_Capacitor_0603]  (hidden comment: 100n/50V)
C76  Package: 0603  [SMD_Capacitor_0603]  (hidden comment: 100n/50V)
C77  Package: 0603  [SMD_Capacitor_0603]  (hidden comment: 100n/50V)
C78  Package: 0603  [SMD_Capacitor_0603]  (hidden comment: 100n/50V)
C79  Package: 0603  [SMD_Capacitor_0603]  (hidden comment: 100n/50V)
R17  R  [0603]
R18  R  [0603]
R19  4.99k/0.01%/5 PPM  [0603_shunt]
R42  100R  [0603]
R43  100R  [0603]
R44  100R  [0603]
U13  MAX31865ATP+  [MAXM-T2055+5_M]

### Ports
RTD_Interface (harness RTD_DIGITAL), RTD_Sensor (harness RTD_SENSOR)

### Harnesses
SPI: SCK, MOSI, MISO
RTD_DIGITAL: SPI, ~{CS}, ~{DRDY}
RTD_SENSOR: RTDIN+, RTDIN-, FORCE+, FORCE-

### Nets
3.3V-analog: C79.1 U13.20(VDD)
3.3V-digital: C78.1 U13.19(DVDD)
AGND: C75.1 C77.2 C79.2 U13.10(GND2) U13.16(GND1) U13.21(EP)
GND: C78.2 U13.15(DGND)
NetC75_2: C75.2 C76.2 R17.1 U13.7(RTDIN+)
NetC76_1: C76.1 C77.1 R18.1 U13.8(RTDIN-)
NetR17_2: R17.2 ; port RTD_Sensor.RTDIN+
NetR18_2: R18.2 ; port RTD_Sensor.RTDIN-
NetR19_1: R19.1 U13.1(BIAS)
NetR19_2: R19.2 U13.2(REFIN+)
NetR19_3: R19.3 U13.3(REFIN-)
NetR19_4: R19.4 U13.4(ISENSOR)
NetR42_1: R42.1 ; harness SPI.SCK
NetR42_2: R42.2 U13.12(SCLK)
NetR43_1: R43.1 ; harness SPI.MOSI
NetR43_2: R43.2 U13.11(SDI)
NetR44_1: R44.1 ; harness SPI.MISO
NetR44_2: R44.2 U13.14(SDO)
NetU13_5: U13.5(FORCE+) ; port RTD_Sensor.FORCE+
NetU13_9: U13.9(FORCE-) ; port RTD_Sensor.FORCE-
NetU13_13: U13.13(~{CS}) ; port RTD_Interface.~{CS}
NetU13_18: U13.18(~{DRDY}) ; port RTD_Interface.~{DRDY}

Not connected (* = marked no-connect by the designer): U13 6(FORCE2)* 17(NC)*

### Notes on the sheet
- Title:
- Sheet:
- of
- Author:
- Model:
- Document Number:
- Checked by:
- Iss-Rev:
- Approved by:
- Date:
- File name:

### Library data of the parts
C75-C79 = Cer_C0603T104K5RALTU: Ceramic Cap Kemet COTS 100n/50V X7R 0603; Manufacturer: Kemet; ManufacturerPartNumber: C0603T104K5RALTU; Value: 100n/50V
R17 R18 R42-R44 = Res: Generic resistor
  R17 R18: value: R
  R42-R44: value: 100R
R19 = Res_Shunt: Generic shunt resistor; value: 4.99k/0.01%/5 PPM
U13 = MAX31865ATP+: RTD-to-Digital Converter, 15 Bits Temperature Resolution, -40 to 125 degC, 20-Pin QFN (T2055+5), Pb-Free; Interface: SPI; Parasite Pwr.: No; DatasheetVersion: Rev. 0; PackageVersion: Rev. Q, 09/2011; PackageReference: T2055+5; PackageDescription: 20-Pin Thin Quad Flatpack, No Leads, Body 5 x 5 mm, Pitch 0.65 mm; Supplier 1: Digi-Key; Supplier Part Number 1: MAX31865ATP+-ND; Supplier 2: Mouser; Supplier Part Number 2: 700-MAX31865ATP+; Functions: RTD-to-Digital Converter; Generic Part Number: MAX31865; Mounting Technology: Surface Mount; Code_JEDEC: MO-220; PartNumber: MAX31865ATP+; ComponentLink1Description: Manufacturer URL; ComponentLink1URL: http://www.maximintegrated.com/; ComponentLink2Description: Datasheet; ComponentLink2URL: http://datasheets.maximintegrated.com/en/ds/MAX31865.pdf; ComponentLink3Description: Package Specification; ComponentLink3URL: http://pdfserv.maximintegrated.com/package_dwgs/21-0140.PDF

## Sheet wifi_ESP8266.SchDoc: WiFi Interface ESP8266
size A4
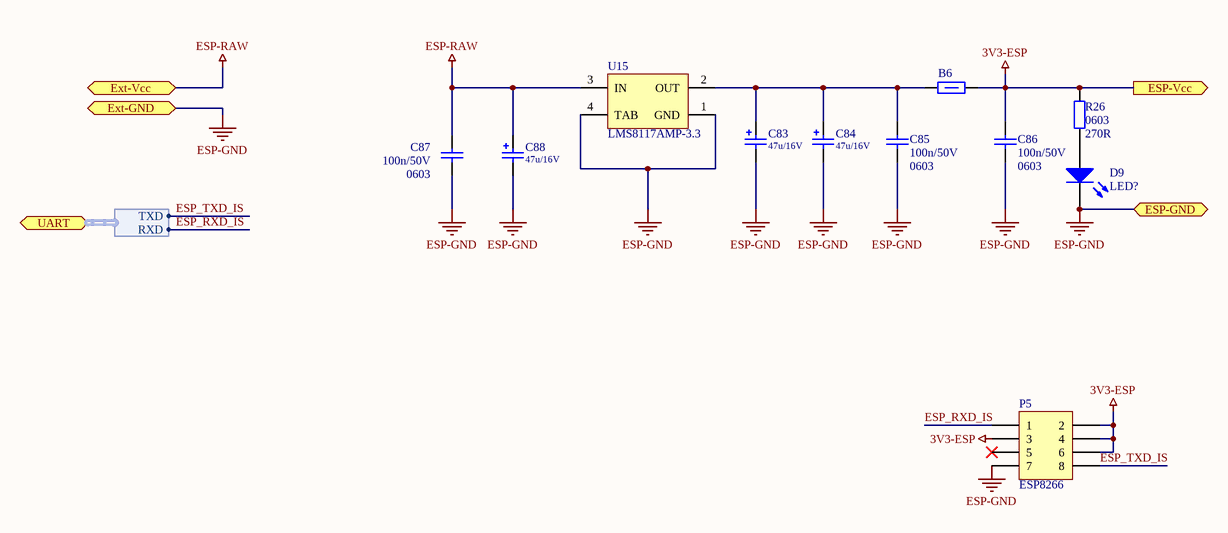
[diagram p8: wifi_ESP8266.SchDoc]

### Parts
B6  120R/100MHz  [SMD_FerriteBead_1206]  (value not drawn)
C83  47u/16V  [Tantalum_cap_B]
C84  47u/16V  [Tantalum_cap_B]
C85  Package: 0603  [SMD_Capacitor_0603]  (hidden comment: 100n/50V)
C86  Package: 0603  [SMD_Capacitor_0603]  (hidden comment: 100n/50V)
C87  Package: 0603  [SMD_Capacitor_0603]  (hidden comment: 100n/50V)
C88  47u/16V  [Tantalum_cap_B]
D9  LED?  [LED 0805 RED]
P5  ESP8266  [HEADER 2X4 FEMALE]
R26  0603  value 270R  [SMD_Resistor_0603]
U15  LMS8117AMP-3.3  [MP04A_M]

### Ports
ESP-GND, ESP-Vcc (out), Ext-GND, Ext-Vcc, UART (harness UART)

### Harnesses
UART: TXD, RXD

### Nets
3V3-ESP: B6.2 C86.1 P5.2 P5.3 P5.4 P5.6 R26.1 ; port ESP-Vcc
ESP-GND: C83.2 C84.2 C85.2 C86.2 C87.2 C88.2 D9.2(K) P5.7 U15.1(GND) U15.4(TAB) ; port ESP-GND, port Ext-GND
ESP-RAW: C87.1 C88.1 U15.3(IN) ; port Ext-Vcc
ESP_RXD_IS: P5.1 ; port UART.RXD
ESP_TXD_IS: P5.8 ; port UART.TXD
NetB6_1: B6.1 C83.1 C84.1 C85.1 U15.2(OUT)
NetD9_1: D9.1(A) R26.2

Not connected (* = marked no-connect by the designer): P5 5*

### Notes on the sheet
- Title:
- Sheet:
- of
- Author:
- Model:
- Document Number:
- Checked by:
- Iss-Rev:
- Approved by:
- Date:
- File name:

### Library data of the parts
B6 = BLM31PG121SH1L: as FB1 on sheet mcu_atmega; Package: 1206; Value: 120R/100MHz; ManufacturerPartNumber: BLM31PG121SH1L
C83 C84 C88 = Cap Tantalum: Tantalum Capacitor; Value: 47u/16V
C85-C87 = Cer_C0603T104K5RALTU: Ceramic Cap Kemet COTS 100n/50V X7R 0603; Manufacturer: Kemet; ManufacturerPartNumber: C0603T104K5RALTU; Value: 100n/50V
D9 = LED3: Typical BLUE SiC LED; Published: 8-Jun-2000; LatestRevisionDate: 17-Dec-2003; LatestRevisionNote: PCB Footprint replaced.; DatasheetVersion: 16-Apr-2002; PackageVersion: 16-Apr-2002; PackageReference: 3.5X2.8X1.9; Publisher: Altium Limited; PackageDescription: SM LED; 2 C-Bend Leads; Body 3.5 x 2.8 x 1.9 mm, inc leads (LxWxH typ)
P5 = Header 4X2: Header, 4-Pin, Dual row; LatestRevisionDate: 17-Jul-2002; LatestRevisionNote: Re-released for DXP Platform.; Publisher: Altium Limited
R26 = Res2: Resistor; Published: 8-Jun-2000; LatestRevisionDate: 17-Jul-2002; LatestRevisionNote: Re-released for DXP Platform.; PackageReference: AXIAL-0.4; Publisher: Altium Limited; PackageDescription: Axial Device, Thru-Hole; 2 Leads; 0.4 in Pin Spacing
U15 = LMS8117AMP-3.3: 1A Low-Dropout Linear Regulator, 4-pin SOT-223; Manufacturer: National Semiconductor; PackageTopMarking: XYTT*LS01; PowerWise: N; CompType: LDO IC; High-Reliability: Y; DatasheetVersion: Apr-2005; PackageVersion: revB, Apr-2003; PackageReference: MP04A; PackageDescription: Molded SOT-223, 6.50 x 3.56 x 1.6mm Body, 4 Lead, 2.3mm Pitch; PartNumber: LMS8117AMP-3.3; RoHS: N; PinCount: 4; Code_JEDEC: TO-261-AA; Code_IPC: SOT223-4; ComponentLink1Description: Manufacturer URL; ComponentLink1URL: http://www.national.com/; ComponentLink2Description: LMS8117A Datasheet; ComponentLink2URL: http://www.national.com/ds/LM/LMS8117A.pdf; ComponentLink3Description: LMS8117A Web Page; ComponentLink3URL: http://www.national.com/pf/LM/LMS8117A.html; ComponentLink4Description: MP04A Package Page; ComponentLink4URL: http://www.national.com/packaging/folders/mp04a.html

## Sheet power_unit.SchDoc
size A3
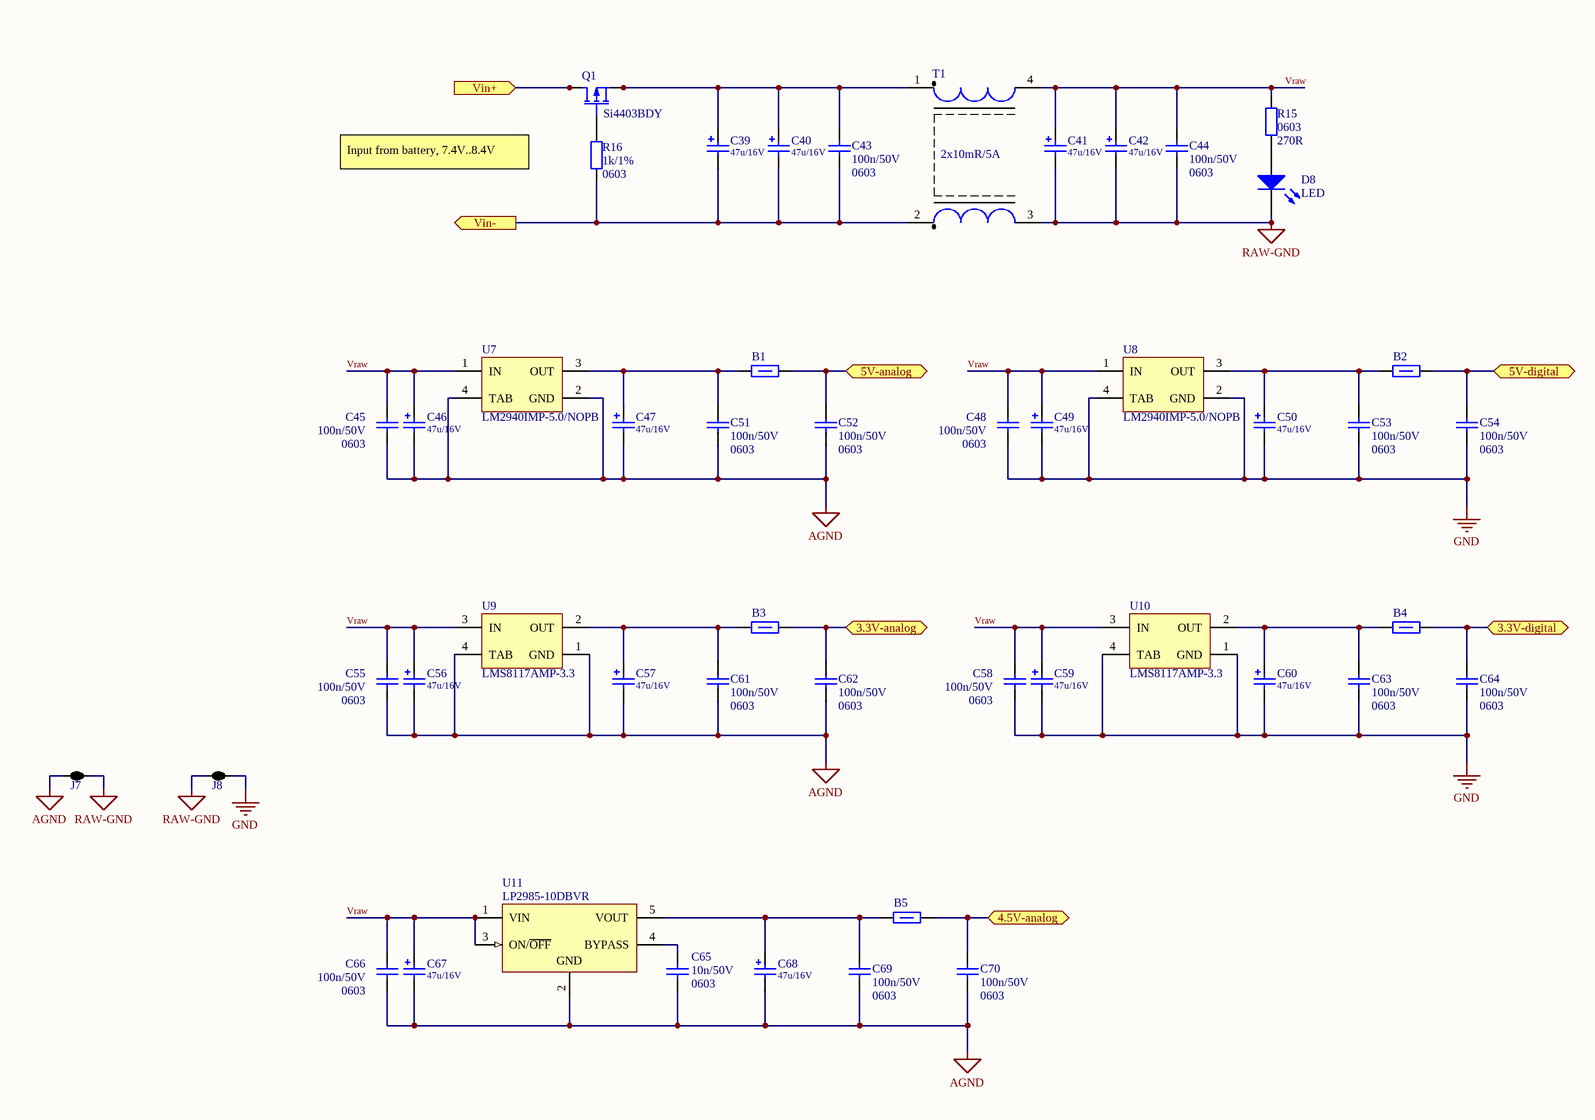
[diagram p9: power_unit.SchDoc]

### Parts
B1  120R/100MHz  [SMD_FerriteBead_1206]  (value not drawn)
B2  120R/100MHz  [SMD_FerriteBead_1206]  (value not drawn)
B3  120R/100MHz  [SMD_FerriteBead_1206]  (value not drawn)
B4  120R/100MHz  [SMD_FerriteBead_1206]  (value not drawn)
B5  120R/100MHz  [SMD_FerriteBead_1206]  (value not drawn)
C39  47u/16V  [Tantalum_cap_B]
C40  47u/16V  [Tantalum_cap_B]
C41  47u/16V  [Tantalum_cap_B]
C42  47u/16V  [Tantalum_cap_B]
C43  Package: 0603  [SMD_Capacitor_0603]  (hidden comment: 100n/50V)
C44  Package: 0603  [SMD_Capacitor_0603]  (hidden comment: 100n/50V)
C45  Package: 0603  [SMD_Capacitor_0603]  (hidden comment: 100n/50V)
C46  47u/16V  [Tantalum_cap_B]
C47  47u/16V  [Tantalum_cap_B]
C48  Package: 0603  [SMD_Capacitor_0603]  (hidden comment: 100n/50V)
C49  47u/16V  [Tantalum_cap_B]
C50  47u/16V  [Tantalum_cap_B]
C51  Package: 0603  [SMD_Capacitor_0603]  (hidden comment: 100n/50V)
C52  Package: 0603  [SMD_Capacitor_0603]  (hidden comment: 100n/50V)
C53  Package: 0603  [SMD_Capacitor_0603]  (hidden comment: 100n/50V)
C54  Package: 0603  [SMD_Capacitor_0603]  (hidden comment: 100n/50V)
C55  Package: 0603  [SMD_Capacitor_0603]  (hidden comment: 100n/50V)
C56  47u/16V  [Tantalum_cap_B]
C57  47u/16V  [Tantalum_cap_B]
C58  Package: 0603  [SMD_Capacitor_0603]  (hidden comment: 100n/50V)
C59  47u/16V  [Tantalum_cap_B]
C60  47u/16V  [Tantalum_cap_B]
C61  Package: 0603  [SMD_Capacitor_0603]  (hidden comment: 100n/50V)
C62  Package: 0603  [SMD_Capacitor_0603]  (hidden comment: 100n/50V)
C63  Package: 0603  [SMD_Capacitor_0603]  (hidden comment: 100n/50V)
C64  Package: 0603  [SMD_Capacitor_0603]  (hidden comment: 100n/50V)
C65  value 10n/50V  Package: 0603  [SMD_Capacitor_0603]  (hidden comment: Cap)
C66  Package: 0603  [SMD_Capacitor_0603]  (hidden comment: 100n/50V)
C67  47u/16V  [Tantalum_cap_B]
C68  47u/16V  [Tantalum_cap_B]
C69  Package: 0603  [SMD_Capacitor_0603]  (hidden comment: 100n/50V)
C70  Package: 0603  [SMD_Capacitor_0603]  (hidden comment: 100n/50V)
D8  LED  [LED 0805 RED]
J7  2 way net tie junction  [2way_MP]  (value not drawn)  (net tie, no BOM)
J8  2 way net tie junction  [2way_MP]  (value not drawn)  (net tie, no BOM)
Q1  Si4403BDY  [SOIC-8_M]
R15  0603  value 270R  [SMD_Resistor_0603]
R16  Package: 0603  [SMD_Resistor_0603]  (hidden comment: 1k/1%)
T1  2x10mR/5A  [TDK_ACM7060]
U7  LM2940IMP-5.0/NOPB  [MP04A_N]
U8  LM2940IMP-5.0/NOPB  [MP04A_N]
U9  LMS8117AMP-3.3  [MP04A_M]
U10  LMS8117AMP-3.3  [MP04A_M]
U11  LP2985-10DBVR  [TI-DBV5_N]

### Ports
3.3V-analog, 3.3V-digital, 4.5V-analog, 5V-analog, 5V-digital, Vin+ (in), Vin- (out)

### Nets
AGND: C45.2 C46.2 C47.2 C51.2 C52.2 C55.2 C56.2 C57.2 C61.2 C62.2 C65.2 C66.2 C67.2 C68.2 C69.2 C70.2 J7.2 U7.2(GND) U7.4(TAB) U9.1(GND) U9.4(TAB) U11.2(GND)
GND: C48.2 C49.2 C50.2 C53.2 C54.2 C58.2 C59.2 C60.2 C63.2 C64.2 J8.1 U8.2(GND) U8.4(TAB) U10.1(GND) U10.4(TAB)
RAW-GND: C41.2 C42.2 C44.2 D8.2(K) J7.1 J8.2 T1.3
3.3V-analog: B3.2 C62.1 ; port 3.3V-analog
3.3V-digital: B4.2 C64.1 ; port 3.3V-digital
4.5V-analog: B5.2 C70.1 ; port 4.5V-analog
5V-analog: B1.2 C52.1 ; port 5V-analog
5V-digital: B2.2 C54.1 ; port 5V-digital
Vin+: Q1.5(D) Q1.6(D) Q1.7(D) Q1.8(D) ; port Vin+
Vin-: C39.2 C40.2 C43.2 R16.2 T1.2 ; port Vin-
Vraw: C41.1 C42.1 C44.1 C45.1 C46.1 C48.1 C49.1 C55.1 C56.1 C58.1 C59.1 C66.1 C67.1 R15.1 T1.4 U7.1(IN) U8.1(IN) U9.3(IN) U10.3(IN) U11.1(VIN) U11.3(ON/~{OFF})
NetB1_1: B1.1 C47.1 C51.1 U7.3(OUT)
NetB2_1: B2.1 C50.1 C53.1 U8.3(OUT)
NetB3_1: B3.1 C57.1 C61.1 U9.2(OUT)
NetB4_1: B4.1 C60.1 C63.1 U10.2(OUT)
NetB5_1: B5.1 C68.1 C69.1 U11.5(VOUT)
NetC39_1: C39.1 C40.1 C43.1 Q1.1(S) Q1.2(S) Q1.3(S) T1.1
NetC65_1: C65.1 U11.4(BYPASS)
NetD8_1: D8.1(A) R15.2
NetQ1_4: Q1.4(G) R16.1

### Notes on the sheet
- Input from battery, 7.4V..8.4V
- Title:
- Sheet:
- of
- Author:
- Model:
- Document Number:
- Checked by:
- Iss-Rev:
- Approved by:
- Date:
- File name:

### Library data of the parts
B1-B5 = BLM31PG121SH1L: as FB1 on sheet mcu_atmega; Package: 1206; Value: 120R/100MHz; ManufacturerPartNumber: BLM31PG121SH1L
C39-C42 C46 C47 C49 C50 C56 C57 C59 C60 C67 C68 = Cap Tantalum: Tantalum Capacitor; Value: 47u/16V
C43-C45 C48 C51-C55 C58 C61-C64 C66 C69 C70 = Cer_C0603T104K5RALTU: Ceramic Cap Kemet COTS 100n/50V X7R 0603; Manufacturer: Kemet; ManufacturerPartNumber: C0603T104K5RALTU; Value: 100n/50V
D8 = LED3: Typical BLUE SiC LED; Published: 8-Jun-2000; LatestRevisionDate: 17-Dec-2003; LatestRevisionNote: PCB Footprint replaced.; DatasheetVersion: 16-Apr-2002; PackageVersion: 16-Apr-2002; PackageReference: 3.5X2.8X1.9; Publisher: Altium Limited; PackageDescription: SM LED; 2 C-Bend Leads; Body 3.5 x 2.8 x 1.9 mm, inc leads (LxWxH typ)
J7 J8 = 2way: ComponentLink1URL: http://www.edatools.cz/addons; ComponentLink1Description: Source; FootprintNote: LP=12mil, MP=40mil, HP=120mil
Q1 = Si4403BDY: P-Channel 1.8 V (G-S) MOSFET; Manufacturer Part Number: Si4403BDY; value: Si4403BDY
R15 = Res2: Resistor; Published: 8-Jun-2000; LatestRevisionDate: 17-Jul-2002; LatestRevisionNote: Re-released for DXP Platform.; PackageReference: AXIAL-0.4; Publisher: Altium Limited; PackageDescription: Axial Device, Thru-Hole; 2 Leads; 0.4 in Pin Spacing
R16 = CRCW06031K00FKxxxx: 1k/1% Vishay CRCW 0603 Resistor. 100mW, 100ppm, 75V.; Manufacturer: Vishay; ManufacturerPartNumber: CRCW06031K00FKxxxx; Value: 1k/1%
T1 = ACM7060-301-2PL-TL01: TDK ACM7060-301 Common Mode Choke; Manufacturer: TDK; ManufacturerPartNumber: ACM7060-301-2PL-TL01; Value: 2x10mR/5A
U7 U8 = LM2940IMP-5.0/NOPB: 1A Low Dropout Regulator, 4-pin SOT-223, Pb-Free; Manufacturer: National Semiconductor; PackageTopMarking: XYTT*L53B; PowerWise: N; CompType: LDO IC; High-Reliability: Y; DatasheetVersion: Jan-2007; PackageVersion: revB, Apr-2003; PackageReference: MP04A; PackageDescription: Molded SOT-223, 6.50 x 3.56 x 1.6mm Body, 4 Lead, 2.3mm Pitch; PartNumber: LM2940IMP-5.0/NOPB; RoHS: Y; PinCount: 4; Code_JEDEC: TO-261-AA; Code_IPC: SOT223-4; ComponentLink1Description: Manufacturer URL; ComponentLink1URL: http://www.national.com/; ComponentLink2Description: LM2940 Datasheet; ComponentLink2URL: http://www.national.com/ds/LM/LM2940.pdf; ComponentLink3Description: LM2940 Web Page; ComponentLink3URL: http://www.national.com/pf/LM/LM2940.html; ComponentLink4Description: MP04A Package Page; ComponentLink4URL: http://www.national.com/packaging/folders/mp04a.html
U9 U10 = LMS8117AMP-3.3: as U15 on sheet wifi_ESP8266; DatasheetVersion: Apr-2005; PackageVersion: revB, Apr-2003; PackageReference: MP04A; PackageDescription: Molded SOT-223, 6.50 x 3.56 x 1.6mm Body, 4 Lead, 2.3mm Pitch; PartNumber: LMS8117AMP-3.3; RoHS: N; PinCount: 4; Code_JEDEC: TO-261-AA; Code_IPC: SOT223-4; ComponentLink1Description: Manufacturer URL; ComponentLink1URL: http://www.national.com/; ComponentLink2Description: LMS8117A Datasheet; ComponentLink2URL: http://www.national.com/ds/LM/LMS8117A.pdf; ComponentLink3Description: LMS8117A Web Page; ComponentLink3URL: http://www.national.com/pf/LM/LMS8117A.html; ComponentLink4Description: MP04A Package Page; ComponentLink4URL: http://www.national.com/packaging/folders/mp04a.html
U11 = LP2985-10DBVR: Single Output Low Noise LDO, 150 mA, Fixed 10 V Output, 2.2 to 16 V Input, with Low IQ, 5-pin SOT-23 (DBV), -40 to 125 degC, Green (RoHS & no Sb/Br); Manufacturer: Texas Instruments; Accuracy(%): 1.5; Fixed Output Options(V): 10; Iout(Max)(A): 0.15; Iq(Typ)(mA): 0.85; SubFamily: Single Channel LDO; Vdo(Typ)(mV): 280; Vin(Max)(V): 16; Vin(Min)(V): 2.2; DatasheetVersion: SLVS522N; PackageVersion: 4073253-4/K; PackageReference: DBV5; PackageDescription: 5-Pin Plastic Small Outline, Body 1.60 Ă— 2.90 mm, Pitch 0.95 mm; Supplier 1: Digi-Key; Supplier Part Number 1: 296-24263-2-ND; Supplier 2: Digi-Key; Supplier Part Number 2: 296-24263-1-ND; Supplier 3: Digi-Key; Supplier Part Number 3: 296-24263-6-ND; Supplier 4: Newark; Supplier Part Number 4: 24R9588; Supplier 5: Mouser; Supplier Part Number 5: 595-LP2985-10DBVR; Eco-Plan: Green (RoHS & no Sb/Br); Vout Adj(Max)(V): 10; Vout Adj(Min)(V): 10; Mounting Technology: Surface Mount; Code_JEDEC: MO-178; PartNumber: LP2985-10DBVR; ComponentLink1Description: Manufacturer URL; ComponentLink1URL: http://www.ti.com/; ComponentLink2Description: Datasheet; ComponentLink2URL: http://www.ti.com/general/docs/lit/getliterature.tsp?genericPartNumber=LP2985-10&fileType=pdf; ComponentLink3Description: Package Specification; ComponentLink3URL: http://www.ti.com/litv/pdf/mpds018i

## Sheet uart_optoizolation.SchDoc: UART Optoizolation
size A4
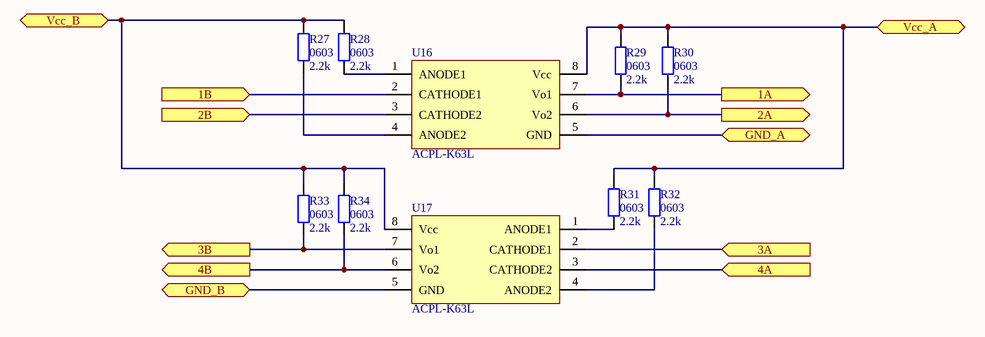
[diagram p10: uart_optoizolation.SchDoc]

### Parts
R27  0603  value 2.2k  [SMD_Resistor_0603]
R28  0603  value 2.2k  [SMD_Resistor_0603]
R29  0603  value 2.2k  [SMD_Resistor_0603]
R30  0603  value 2.2k  [SMD_Resistor_0603]
R31  0603  value 2.2k  [SMD_Resistor_0603]
R32  0603  value 2.2k  [SMD_Resistor_0603]
R33  0603  value 2.2k  [SMD_Resistor_0603]
R34  0603  value 2.2k  [SMD_Resistor_0603]
U16  ACPL-K63L  [SOIC-8_M]
U17  ACPL-K63L  [SOIC-8_M]

### Ports
1A (out), 1B (in), 2A (out), 2B (in), 3A (in), 3B (out), 4A (in), 4B (out), GND_A, GND_B, Vcc_A, Vcc_B

### Nets
1A: R29.1 U16.7(Vo1) ; port 1A
1B: U16.2(CATHODE1) ; port 1B
2A: R30.1 U16.6(Vo2) ; port 2A
2B: U16.3(CATHODE2) ; port 2B
3A: U17.2(CATHODE1) ; port 3A
3B: R33.1 U17.7(Vo1) ; port 3B
4A: U17.3(CATHODE2) ; port 4A
4B: R34.1 U17.6(Vo2) ; port 4B
GND_A: U16.5(GND) ; port GND_A
GND_B: U17.5(GND) ; port GND_B
Vcc_A: R29.2 R30.2 R31.2 R32.2 U16.8(Vcc) ; port Vcc_A
Vcc_B: R27.2 R28.2 R33.2 R34.2 U17.8(Vcc) ; port Vcc_B
NetR27_1: R27.1 U16.4(ANODE2)
NetR28_1: R28.1 U16.1(ANODE1)
NetR31_1: R31.1 U17.1(ANODE1)
NetR32_1: R32.1 U17.4(ANODE2)

### Notes on the sheet
- Title:
- Sheet:
- of
- Author:
- Model:
- Document Number:
- Checked by:
- Iss-Rev:
- Approved by:
- Date:
- File name:

### Library data of the parts
R27-R34 = Res2: Resistor; Published: 8-Jun-2000; LatestRevisionDate: 17-Jul-2002; LatestRevisionNote: Re-released for DXP Platform.; PackageReference: AXIAL-0.4; Publisher: Altium Limited; PackageDescription: Axial Device, Thru-Hole; 2 Leads; 0.4 in Pin Spacing
U16 U17 = ACPL-K63L: High Speed LVTTL Compatible 3.3 Volt/5 Volt Optocouplers

## Nets that join several sheets
3.3V-digital: adc_AD7714 (C5.1 C7.1 U1.5 U1.23), mcu_atmega (9 pins), rtd_interface_MAX31865 (C78.1 U13.19)
4.5V-analog: adc_AD7714 (J6.2), reference_2v5_LTC6655 (C9.1 C10.1 U2.2), voltage_adj_current_source (U14.8), reference_0v5_ADR130 (C72.1 C74.1 U12.3)
AGND: adc_AD7714 (5 pins), reference_2v5_LTC6655 (5 pins), voltage_adj_current_source (C82.1 R21.1 U14.4), reference_0v5_ADR130 (5 pins), Differential Low-Pass Filter (C89_Differential_Low-Pass_Filter#1.2 C91_Differential_Low-Pass_Filter#1.1), Differential Low-Pass Filter (C89_Differential_Low-Pass_Filter#2.2 C91_Differential_Low-Pass_Filter#2.1), Differential Low-Pass Filter (C89_Differential_Low-Pass_Filter#3.2 C91_Differential_Low-Pass_Filter#3.1), rtd_interface_MAX31865 (6 pins), power_unit (22 pins)
GND: adc_AD7714 (6 pins), mcu_atmega (20 pins), rtd_interface_MAX31865 (C78.2 U13.15), power_unit (15 pins)
NetC89_Differential_Low-Pass_Filter#1_1: adc_AD7714 (U1.7), Differential Low-Pass Filter (C89_Differential_Low-Pass_Filter#1.1 C90_Differential_Low-Pass_Filter#1.1 R35_Differential_Low-Pass_Filter#1.2)
NetC89_Differential_Low-Pass_Filter#2_1: adc_AD7714 (U1.9), Differential Low-Pass Filter (C89_Differential_Low-Pass_Filter#2.1 C90_Differential_Low-Pass_Filter#2.1 R35_Differential_Low-Pass_Filter#2.2)
NetC89_Differential_Low-Pass_Filter#3_1: adc_AD7714 (U1.16), Differential Low-Pass Filter (C89_Differential_Low-Pass_Filter#3.1 C90_Differential_Low-Pass_Filter#3.1 R35_Differential_Low-Pass_Filter#3.2)
NetC90_Differential_Low-Pass_Filter#1_2: adc_AD7714 (U1.8), Differential Low-Pass Filter (C90_Differential_Low-Pass_Filter#1.2 C91_Differential_Low-Pass_Filter#1.2 R36_Differential_Low-Pass_Filter#1.2)
NetC90_Differential_Low-Pass_Filter#2_2: adc_AD7714 (U1.10), Differential Low-Pass Filter (C90_Differential_Low-Pass_Filter#2.2 C91_Differential_Low-Pass_Filter#2.2 R36_Differential_Low-Pass_Filter#2.2)
NetC90_Differential_Low-Pass_Filter#3_2: adc_AD7714 (U1.17), Differential Low-Pass Filter (C90_Differential_Low-Pass_Filter#3.2 C91_Differential_Low-Pass_Filter#3.2 R36_Differential_Low-Pass_Filter#3.2)
Ref-0.5V: analog_backend (P1.1), reference_0v5_ADR130 (C71.1 C73.1 U12.4 U12.5)
Ref-2.5V: adc_AD7714 (C1.1 U1.15), reference_2v5_LTC6655 (C8.1 C11.1 U2.6)
Vctrl: analog_backend (P1.2), voltage_adj_current_source (C82.2 R25.1)